# EAGLE design cytron-1 (EAGLE 9.6.2)
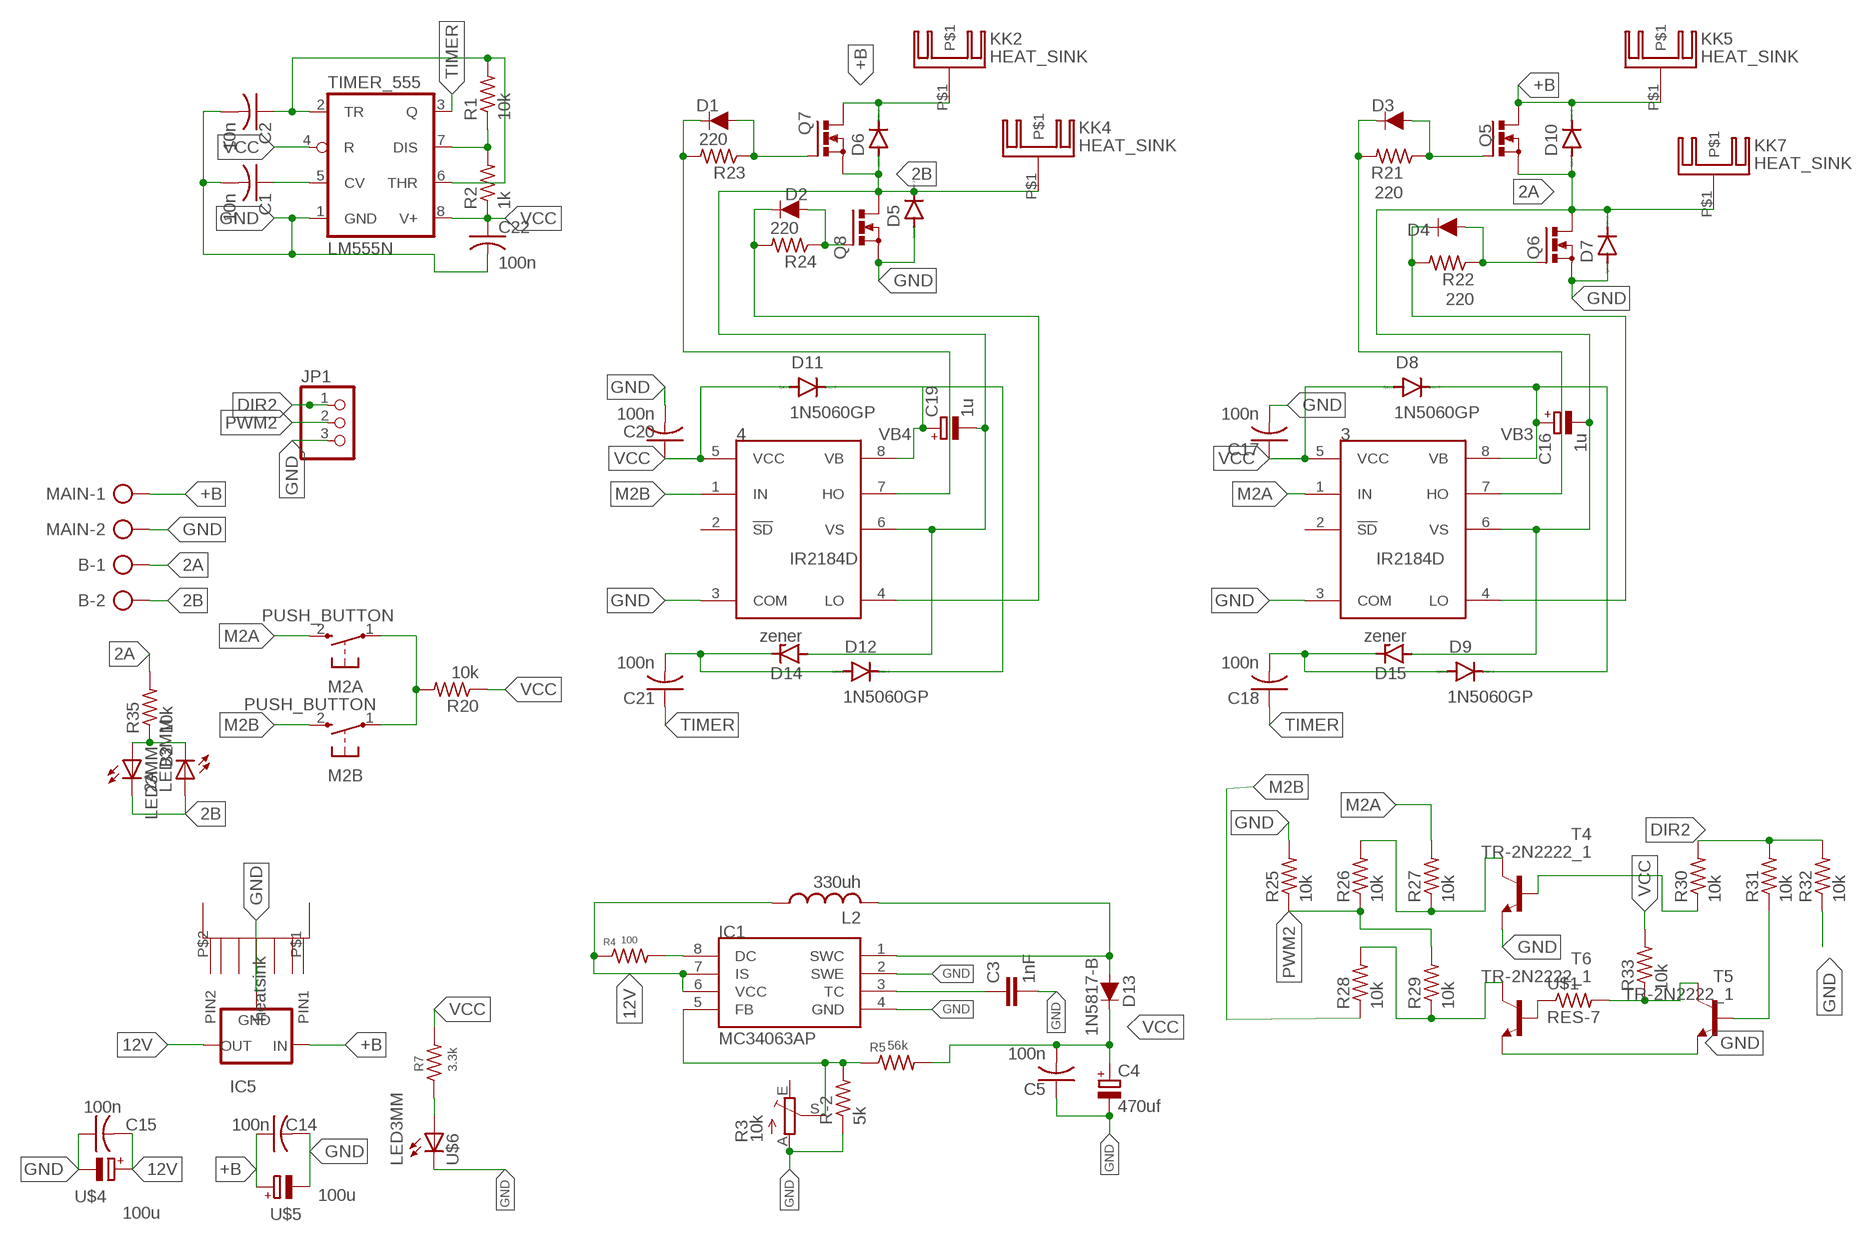
[diagram p0: schematic, sheet 1]

## Parts
2A  LED3MM  [LED3MM]
3  IR2184D  [DIL08]
4  IR2184D  [DIL08]
B  ROSTA.POWER  [W239-302]
B2  LED3MM  [LED3MM]
C1  10n  C-US025-025X050  [C025-025X050]
C2  10n  C-US025-025X050  [C025-025X050]
C3  1nF  CAPACITOR  [C025-025X050]
C4  470uf  CAP_POL  [E3,5-8]
C5  100n  C-US025-025X050  [C025-025X050]
C14  100n  C-US025-025X050  [C025-025X050]
C15  100n  C-US025-025X050  [C025-025X050]
C16  1u  CPOL-EUE5-5  [E5-5]
C17  100n  C-US025-025X050  [C025-025X050]
C18  100n  C-US025-025X050  [C025-025X050]
C19  1u  CPOL-EUE5-5  [E5-5]
C20  100n  C-US025-025X050  [C025-025X050]
C21  100n  C-US025-025X050  [C025-025X050]
C22  100n  C-US025-025X050  [C025-025X050]
D1  1A/50V/1.1V  DIODE(1A)-PTH  [DIODE-1N4001]
D2  1A/50V/1.1V  DIODE(1A)-PTH  [DIODE-1N4001]
D3  1A/50V/1.1V  DIODE(1A)-PTH  [DIODE-1N4001]
D4  1A/50V/1.1V  DIODE(1A)-PTH  [DIODE-1N4001]
D5  BY396  [DO201-15]
D6  BY396  [DO201-15]
D7  BY396  [DO201-15]
D8  1N5060GP  [DO15-12]
D9  1N5060GP  [DO15-12]
D10  BY396  [DO201-15]
D11  1N5060GP  [DO15-12]
D12  1N5060GP  [DO15-12]
D13  1N5817-B  DIODE(1A)-PTH  [DIODE-1N4001]
D14  zener  BZD23  [SOD81]
D15  zener  BZD23  [SOD81]
IC1  MC34063AP  [DIL08]
IC5  78XXS  [78XXS]
JP1  PINHD-3_DATA  [1X03_DATA]
KK2  HEAT_SINK  [SK95-2M3]
KK4  HEAT_SINK  [SK95-2M3]
KK5  HEAT_SINK  [SK95-2M3]
KK7  HEAT_SINK  [SK95-2M3]
L2  330uh  L-USWE-TPC  [POWER-CHOKE_WE-TPC]
M2A  PUSH_BUTTON  [B3F-10XX]
M2B  PUSH_BUTTON  [B3F-10XX]
MAIN  ROSTA.POWER  [W239-302]
Q5  MOSFET_NTO220BV  [TO220BV]
Q6  MOSFET_NTO220BV  [TO220BV]
Q7  MOSFET_NTO220BV  [TO220BV]
Q8  MOSFET_NTO220BV  [TO220BV]
R1  10k  R-US_0204/7  [0204/7]
R2  1k  R-US_0204/7  [0204/7]
R3  10k  TRIM_EU-CA6V  [CA6V]
R4  100  RES-7  [0204/7]
R5  56k  RES-7  [0204/7]
R7  3.3k  RES-7  [0204/7]
R20  10k  R-US_0204/7  [0204/7]
R21  220  R-US_0204/7  [0204/7]
R22  220  R-US_0204/7  [0204/7]
R23  220  R-US_0204/7  [0204/7]
R24  220  R-US_0204/7  [0204/7]
R25  10k  R-US_0204/7  [0204/7]
R26  10k  R-US_0204/7  [0204/7]
R27  10k  R-US_0204/7  [0204/7]
R28  10k  R-US_0204/7  [0204/7]
R29  10k  R-US_0204/7  [0204/7]
R30  10k  R-US_0204/7  [0204/7]
R31  10k  R-US_0204/7  [0204/7]
R32  10k  R-US_0204/7  [0204/7]
R33  10k  R-US_0204/7  [0204/7]
R35  10k  R-US_0204/7  [0204/7]
R-2  5k  RES-7  [0204/7]
T4  TR-2N2222_1  [TO92-EBC]
T5  TR-2N2222_1  [TO92-EBC]
T6  TR-2N2222_1  [TO92-EBC]
TIMER_555  LM555N  [DIL08]
U$1  RES-7  [0204/7]
U$3  HEAT-SINK  [HEAT_SINK]
U$4  100u  CAP_POL  [E3,5-8]
U$5  100u  CAP_POL  [E3,5-8]
U$6  LED3MM  [LED3MM]

## Nets
2A: 3.6(VS) B.1 C16.- D7.C D10.A D15.A KK7.P$1 Q5.S Q6.D R35.2
2B: 2A.K(C) 4.6(VS) B2.A B.2 C19.- D5.C D6.A D14.A KK4.P$1 Q7.S Q8.D
12V: C15.2 IC1.6(VCC) IC1.7(IS) IC5.OUT L2.1 R4.1 U$4.+
+B: C14.1 D6.C D10.C IC5.IN KK2.P$1 KK5.P$1 MAIN.1 Q5.D Q7.D U$5.+
DIR2: JP1.1 R30.2 R31.2 R32.2
GND: 3.3(COM) 4.3(COM) C1.2 C2.2 C3.2 C4.- C5.1 C14.2 C15.1 C17.2 C20.2 C22.2 D5.A D7.A IC1.2(SWE) IC1.4(GND) IC5.GND JP1.3 MAIN.2 Q6.S Q8.S R3.A R25.2 R32.1 R-2.1 T4.E T5.E T6.E TIMER_555.1(GND) U$4.- U$5.- U$6.K(C)
M2A: 3.1(IN) M2A.2(S) R27.2
M2B: 4.1(IN) M2B.2(S) R28.1
N$2: C1.1 TIMER_555.5(CV)
N$3: R1.1 R2.2 TIMER_555.7(DIS)
N$4: C2.1 R1.2 TIMER_555.2(TR) TIMER_555.6(THR)
N$5: D4.A Q6.G R22.1
N$6: 3.4(LO) D4.C R22.2
N$7: M2A.1(P) M2B.1(P) R20.2
N$8: T6.B U$1.1
N$9: C3.1 IC1.3(TC)
N$10: D13.A IC1.1(SWC) L2.2
N$11: 4.7(HO) D1.C R23.2
N$12: IC1.5(FB) R3.S R5.1 R-2.2
N$13: 4.4(LO) D2.C R24.2
N$15: IC1.8(DC) R4.2
N$16: R7.1 U$6.A
N$25: D3.A Q5.G R21.1
N$30: 3.7(HO) D3.C R21.2
N$31: C18.2 D9.A D15.C
N$32: D2.A Q8.G R24.1
N$33: D1.A Q7.G R23.1
N$36: C21.2 D12.A D14.C
N$37: R28.2 R29.1 T6.C
N$38: R26.2 R27.1 T4.C
N$39: R30.1 T4.B
N$40: R33.1 T5.C U$1.2
N$41: R31.1 T5.B
N$46: 2A.A B2.K(C) R35.1
PWM2: JP1.2 R25.1 R26.1 R29.2
TIMER: C18.1 C21.1 TIMER_555.3(Q)
VB3: 3.8(VB) C16.+ D8.C D9.C
VB4: 4.8(VB) C19.+ D11.C D12.C
VCC: 3.5(VCC) 4.5(VCC) C4.+ C5.2 C17.1 C20.1 C22.1 D8.A D11.A D13.C R2.1 R5.2 R7.2 R20.1 R33.2 TIMER_555.4(R) TIMER_555.8(V+)
Unconnected: 3.2(!SD) 4.2(!SD) R3.E U$3.P$1(PIN1) U$3.P$2(PIN2)

## Library data of the parts
2A B2 = MIA_LIBRARY-2-2-2:LED3MM
3 4 = MIA_LIBRARY-2-2-2:IR2184
B MAIN = MIA_LIBRARY-2-2-2:ROSTA.POWER: WAGO SCREW CLAMP; OC_FARNELL: unknown; OC_NEWARK: unknown
C1 C2 C5 C14 C15 C17 C18 C20-C22 = rcl8:C-US: CAPACITOR, American symbol; SPICEPREFIX: C
C3 = MIA_LIBRARY-2-2-2:CAPACITOR; SPICEPREFIX: C
C4 = MIA_LIBRARY-2-2-2:CAP_POL; SPICEPREFIX: C
C16 C19 = rcl8:CPOL-EU: POLARIZED CAPACITOR, European symbol; SPICEPREFIX: C
D1-D4 = MIA_LIBRARY-2-2-2:DIODE(1A): Diode These are standard reverse protection diodes and small signal diodes. SparkFun Products: SparkFun SparkPunk Sound Kit <https://www.sparkfun.com/products/11177> SparkFun ESP8266 Thing <https://www.sparkfun.com/products/13231>; PROD_ID: DIO-09176
D5-D7 D10 = diode:BY396: DIODE Si,100 V, 3 A
D8 D9 D11 D12 = diode:1N5060GP: DIODE controlled avalanche rectifier
D13 = MIA_LIBRARY-2-2-2:DIODE(1A): Diode These are standard reverse protection diodes and small signal diodes. SparkFun Products: SparkFun SparkPunk Sound Kit <https://www.sparkfun.com/products/11177> SparkFun ESP8266 Thing <https://www.sparkfun.com/products/13231>; PROD_ID: DIO-09176; SPICEPREFIX: D; VALUE: 1A/50V/1.1V
D14 D15 = diode:BZD23: Z DIODE
IC1 = MIA_LIBRARY-2-2-2:MC34063; SPICEPREFIX: X
IC5 = MIA_LIBRARY-2-2-2:78XXS: VOLTAGE REGULATOR
JP1 = MIA_LIBRARY-2-2-2:PINHD-3_DATA: PIN HEADER
KK2 KK4 KK5 KK7 = MIA_LIBRARY-2-2-2:HEAT_SINK: HEATSINK manufacturer Fischer/distributor Buerklin
L2 = rcl:L-US: INDUCTOR, American symbol; SPICEPREFIX: L
M2A M2B = MIA_LIBRARY-2-2-2:PUSH_BUTTON: OMRON SWITCH
Q5-Q8 = MIA_LIBRARY-2-2-2:MOSFET_N: Power MOSFET N-Channel
R1 R2 R20-R33 R35 = rcl8:R-US_: RESISTOR, American symbol; SPICEPREFIX: R
R3 = MIA_LIBRARY-2-2-2:TRIM_EU-: POTENTIOMETER; SPICEPREFIX: J
R4 R5 R7 = MIA_LIBRARY-2-2-2:RES-7; SPICEPREFIX: R
R-2 = MIA_LIBRARY-2-2-2:RES-7
T4-T6 = MIA_LIBRARY-2-2-2:TR-2N2222_1: NPN TRANSISTOR; SPICEPREFIX: J
TIMER_555 = linear:*555: TIMER
U$1 = MIA_LIBRARY-2-2-2:RES-7; SPICEPREFIX: B
U$3 = MIA_LIBRARY-2-2-2:HEAT-SINK
U$4 U$5 = MIA_LIBRARY-2-2-2:CAP_POL
U$6 = MIA_LIBRARY-2-2-2:LED3MM; SPICEPREFIX: B

## Board
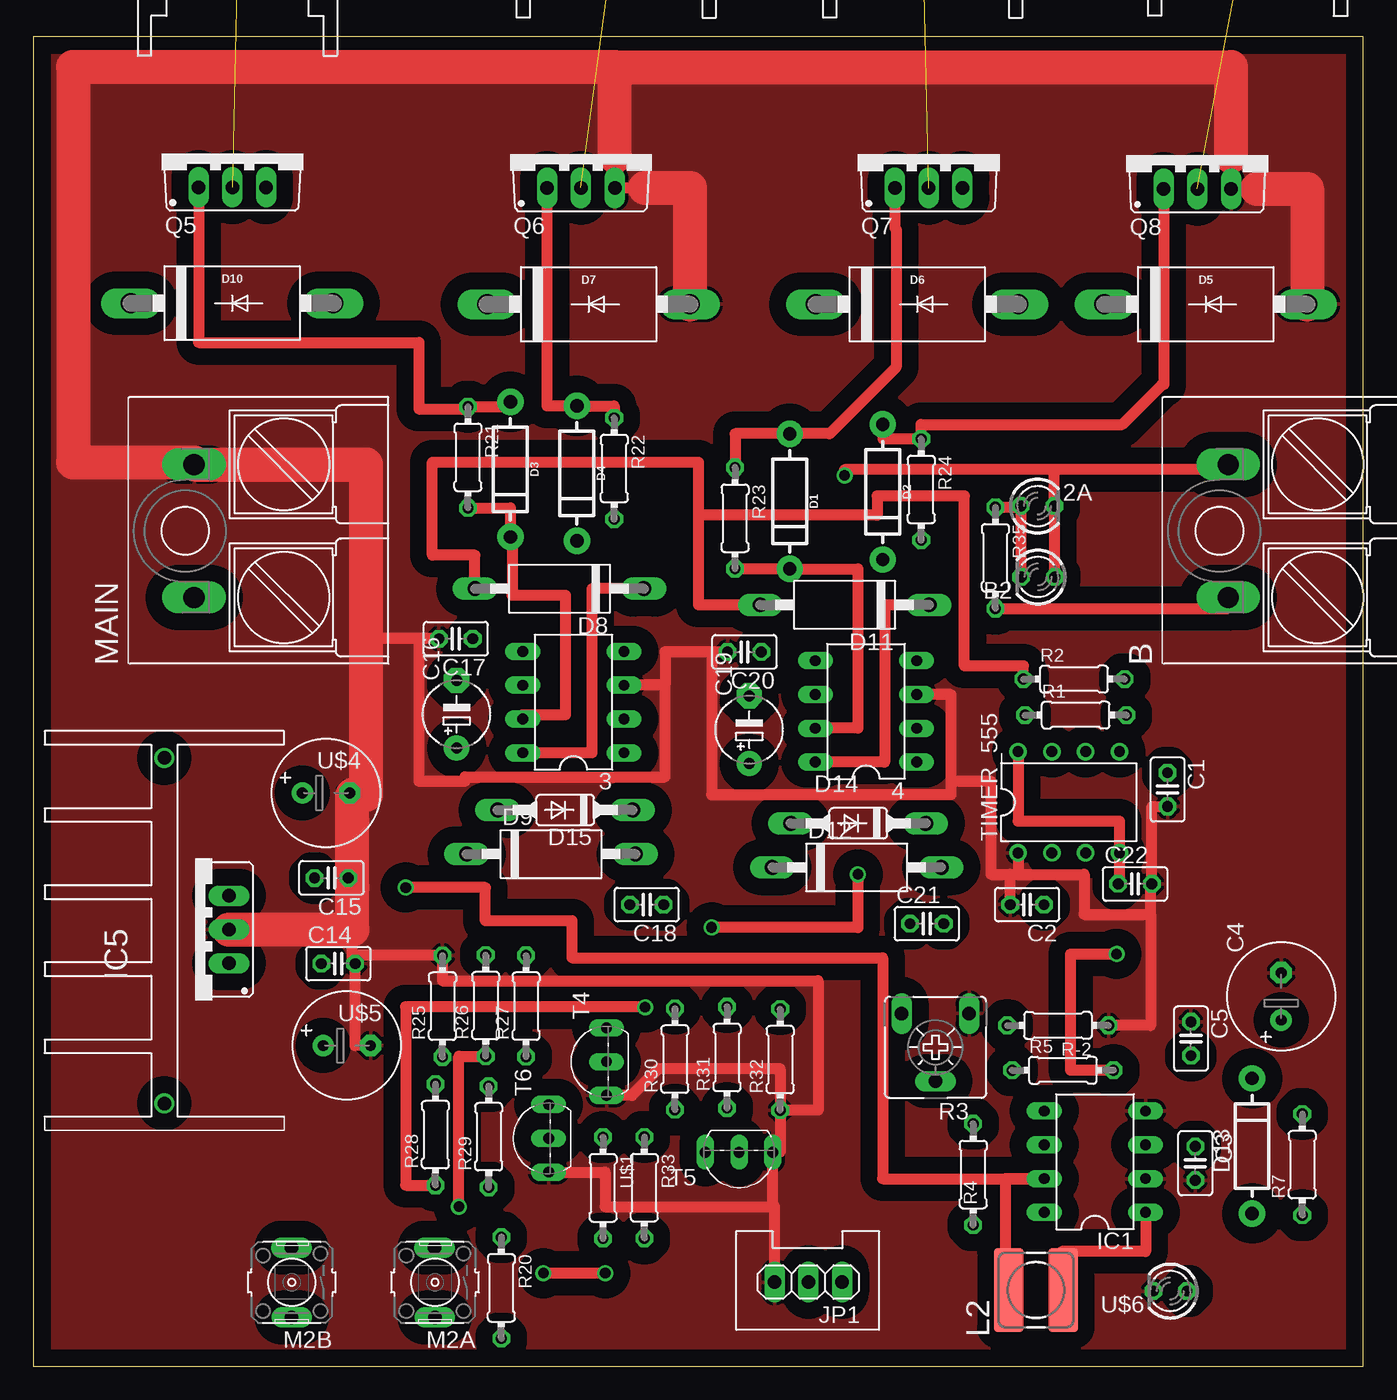
[diagram p1: board, top side]
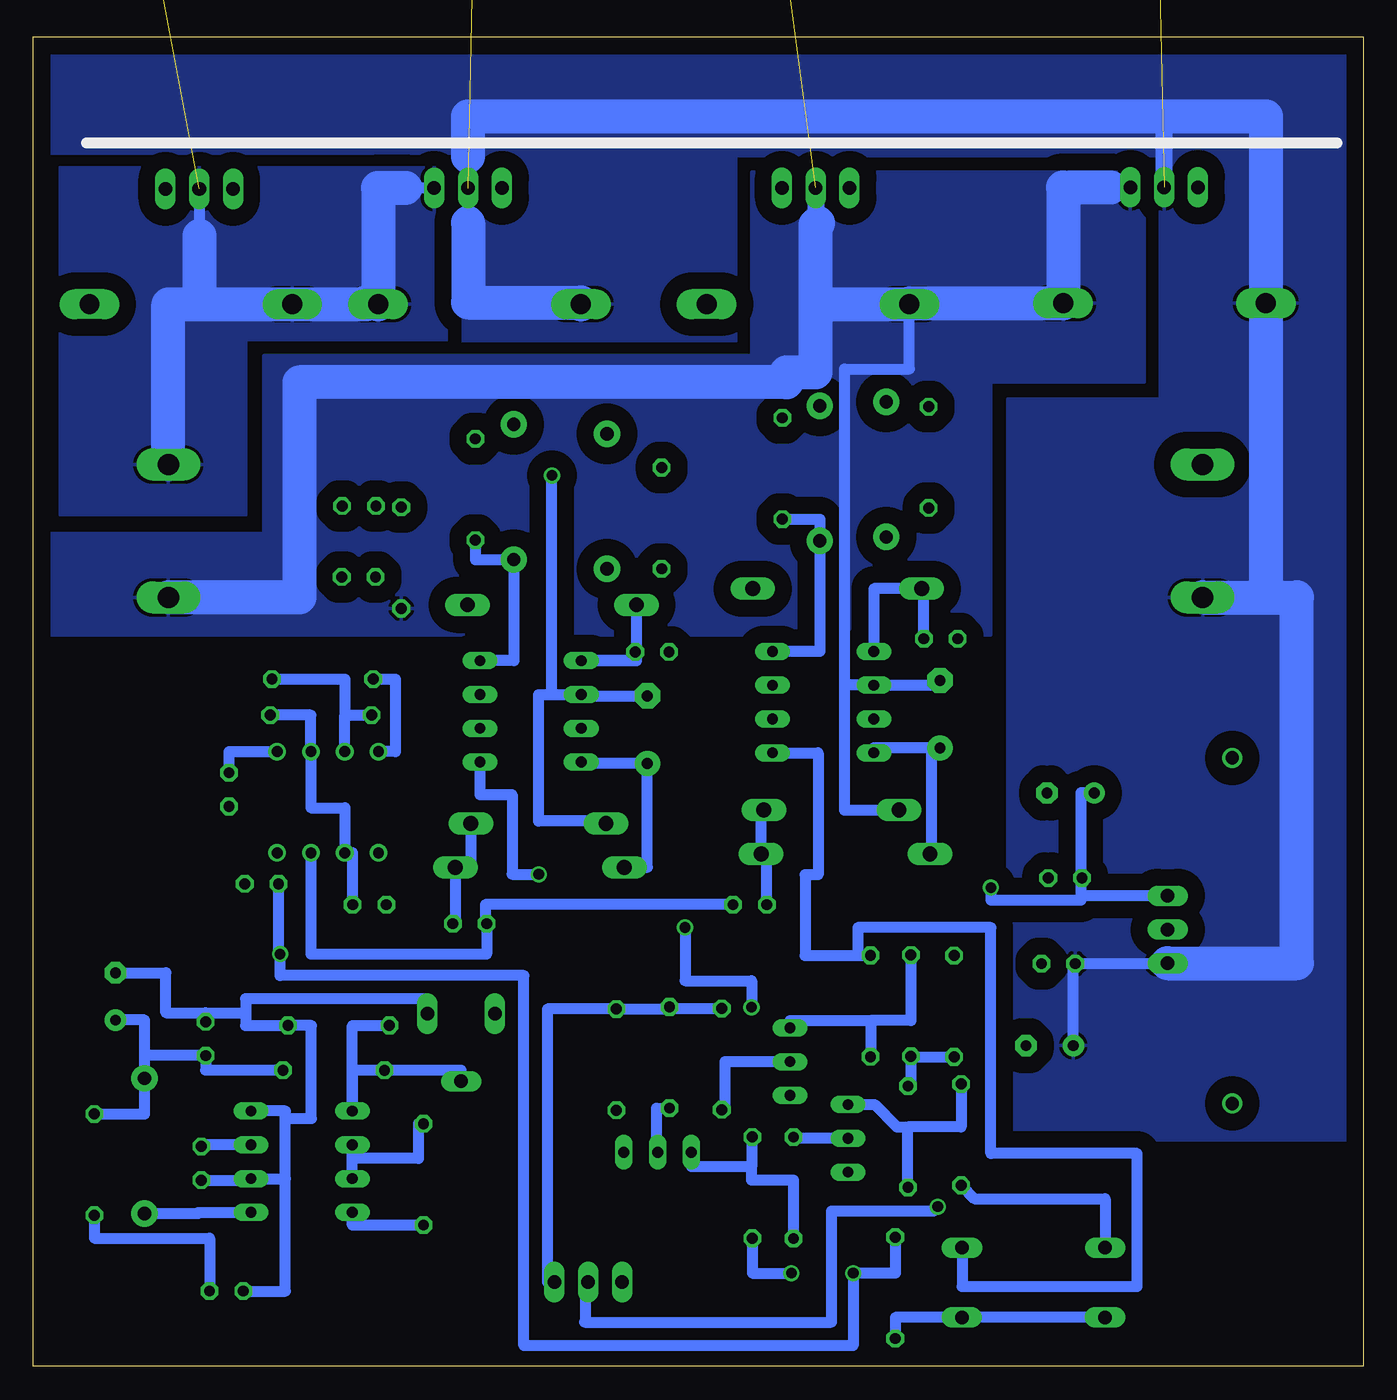
[diagram p2: board, bottom side, seen from below]

Size 100 x 100 mm. Coordinates in mm from the lower left corner, seen from the top.
Outline: 0,0 100,0 100,100 0,100 0,0
Copper layers (1*16): Top 0.035mm / dielectric 1.5mm / Bottom 0.035mm
Design rules "default *": minimum track width 6mil, minimum drill 0.35mm, track to track 0.8mm, track to pad 6mil, pad to pad 6mil, via to via 6mil, smd to smd 6mil, copper to edge 40mil, drill to drill 6mil, minimum pad ring 10mil, minimum via ring 8mil, stop-mask expansion 4mil, vias tented up to drill 0mil, thermal gap 10mil

### Footprints (pad centres in the part's own frame; a part is rotated, then mirrored left to right if it is on the bottom)
LED3MM = drill 0.813 octagon: A -1.27,0; K 1.27,0
DIL08 = drill 0.813 long: 1 -3.81,-3.81; 2 -1.27,-3.81; 3 1.27,-3.81; 4 3.81,-3.81; 5 3.81,3.81; 6 1.27,3.81; 7 -1.27,3.81; 8 -3.81,3.81
W239-302 = drill 1.6 long: 1 -5,5; 2 5,5
C025-025X050 = drill 0.813 octagon: 1 -1.27,0; 2 1.27,0
E3,5-8 = drill 0.813 pad 1.6: + -1.778,0 | drill 0.813 pad 1.6 octagon: - 1.778,0
E5-5 = drill 0.813 pad 1.905: + -2.54,0 | drill 0.813 pad 1.905 octagon: - 2.54,0
DIODE-1N4001 = drill 1 pad 1.981: A -5.08,0; C 5.08,0
DO201-15 = drill 1.499 long: A 7.62,0; C -7.62,0
DO15-12 = drill 1.118 long: A 6.35,0; C -6.35,0
SOD81 = drill 1.118 long: A 5.08,0; C -5.08,0
78XXS = drill 1.016 long: GND 0,-2.54; IN -2.54,-2.54; OUT 2.54,-2.54
1X03_DATA = drill 1.016 long: 1 -2.54,0; 2 0,0; 3 2.54,0
SK95-2M3 = drill 0.6 offset: P$1 0,2
POWER-CHOKE_WE-TPC = smd 6.3 x 2.2: 1 0,2.05; 2 0,-2.05
B3F-10XX = drill 1.016 long: 1 0.013,2.636; 2 0.029,-2.605
TO220BV = drill 1.016 long: D 0,-2.54; G -2.54,-2.54; S 2.54,-2.54
0204/7 = drill 0.813 octagon: 1 -3.81,0; 2 3.81,0
CA6V = drill 1.016 long: A -2.54,-2.54; E 2.54,-2.54; S 0,2.54
TO92-EBC = drill 0.813 long: B 0,-1.27; C 2.54,-1.27; E -2.54,-1.27
DIL08' = drill 0.813 pad 1.27: 1 -3.81,-3.81; 2 -1.27,-3.81; 3 1.27,-3.81; 4 3.81,-3.81; 5 3.81,3.81; 6 1.27,3.81; 7 -1.27,3.81; 8 -3.81,3.81
HEAT_SINK = drill 1: P$1 0,13; P$2 0,-13

### Placement (x,y rotation side)
2A  75.5,64.7 0 top
3  40.61,49.95 90 top
4  62.61,49.25 90 top
B  94.84,62.82 90 top
B2  75.54,59.36 180 top
C1  85.28,43.37 270 top
C2  74.72,34.72 180 top
C3  87.37,15.27 270 top
C4  93.82,27.82 90 top
C5  87.04,24.64 270 top
C14  22.93,30.28 0 top
C15  22.42,36.72 180 top
C16  31.83,49.04 90 top
C17  31.77,54.72 180 top
C18  46.12,34.72 180 top
C19  53.83,47.88 90 top
C20  53.47,53.72 180 top
C21  67.18,33.28 0 top
C22  82.83,36.28 0 top
D1  56.87,65.05 270 top
D2  63.87,65.75 270 top
D3  35.87,67.45 270 top
D4  40.87,67.15 270 top
D5  88.15,79.87 0 top
D6  66.45,79.87 0 top
D7  41.75,79.87 0 top
D8  39.56,58.48 180 top
D9  38.93,38.52 0 top
D10  14.95,79.95 0 top
D11  61,57.27 180 top
D12  61.91,37.52 0 top
D13  91.63,16.57 90 top
D14  62.02,40.83 180 top
D15  39.99,41.83 180 top
IC1  79.82,15.38 90 top
IC5  12.17,32.85 90 top
JP1  58.28,6.33 180 top
KK2  15.34,103.56 0 top  (outside the outline)
KK4  91.29,106.56 0 top  (outside the outline)
KK5  66.87,106.42 0 top  (outside the outline)
KK7  43.82,106.42 0 top  (outside the outline)
L2  75.39,5.74 90 top
M2A  30.2,6.31 180 top
M2B  19.44,6.31 180 top
MAIN  17.09,62.82 90 top
Q5  14.98,91.21 0 top
Q6  41.18,91.17 0 top
Q7  67.31,91.15 0 top
Q8  87.52,91.09 0 top
R1  78.37,48.98 0 top
R2  78.25,51.68 0 top
R3  67.83,23.98 180 top
R4  70.67,14.43 270 top
R5  77.41,22.27 0 top
R7  95.41,15.16 90 top
R20  35.19,5.9 270 top
R21  32.68,68.36 270 top
R22  43.68,67.52 270 top
R23  52.76,63.78 270 top
R24  66.76,65.94 270 top
R25  30.77,27.08 90 top
R26  34.02,27.12 90 top
R27  37.05,27.09 90 top
R28  30.24,17.42 90 top
R29  34.24,17.26 90 top
R30  48.24,23.1 90 top
R31  52.16,23.22 90 top
R32  56.16,23.06 90 top
R33  45.94,13.44 270 top
R35  72.33,60.8 270 top
R-2  77.04,25.64 180 top
T4  41.83,22.91 90 top
T5  53.06,14.83 180 top
T6  37.48,17.14 90 top
TIMER_555  LM555N  [DIL08']  77.85,42.42 0 top
U$1  42.84,13.42 270 top
U$3  9.86,32.76 180 top
U$4  22.01,43.12 0 top
U$5  23.58,24.12 0 top
U$6  85.48,5.66 180 top

### Tracks (layer width: path | path; a pad name or v marks a point on that pad's centre or on a via)
2A  (1 unrouted)
  Top 0.813: R35.2 89.84,56.99 B.1
  Bottom 0.813: C16.- 31.83,51.22 3.6 39,51.22 | D15.A 39,41.83 39,51.22 | 39,51.22 39,75 34.13,75 D7.C
  Bottom 1.27: 19,88.67 Q5.S | 22.57,88.67 22,88.67 | Q6.D 41.18,86.18 41,86
  Bottom 2.54: 41.18,79.87 D7.C 34.13,79.95 D10.A 22.57,88.67 | 41.18,79.87 41.18,74.75 43.38,74.75 43.38,74 80,74 80,57.82 B.1 | 41.18,79.87 41.18,85.82 41,86 | 22,88.67 19,88.67
  pour Bottom (isolate 1.27): 16.46,89.79 16.46,74 28,74 28,55 99,55 99,62.61 82.68,62.61 82.68,76 46,76 46,89.79
2B  (via drill 0.8)  (1 unrouted)
  Top 0.813: B.2 89.84,67.43 76.77,67.43 | 76.77,67.43 61,67.43 v61,67 | B2.A 76.77,59.36 2A.K 76.77,67.43
  Bottom 0.813: C19.- 58.8,50.42 4.6 61,50.52 | D14.A 56.94,41 62,41 62,50.52 61,50.52 | 61,50.52 v61,67 | Q7.S 72,88.61 | Q8.D 87.52,85
  Bottom 2.54: 87.52,85 87.52,79.87 | 87.52,79.87 D5.C 75,79.87 75,80 74.07,80 D6.A 74.07,88.61 72,88.61 | B.2 89.84,79.87 87.52,79.87
  pour Bottom (isolate 1.27): 68.91,90.17 68.91,77.18 84,77.18 84,64 98,64 98,90.17
12V  (via drill 0.8)
  Top 0.813: L2.1 73.09,5.74 73.09,14.12 IC1.7 63.87,14.12 63.87,30.72 40.5,30.72 40.5,33.5 34,33.5 34,36 v28,36
  Bottom 0.813: IC1.7 IC1.6 76.01,15.63 71.04,15.63 71.04,18.23 R4.1 | IC5.OUT 21.23,35.39 | U$4.+ 21.23,43.12 21.23,36.72 | C15.2 21.23,36.72 | 21.23,36.72 21.23,35.39 | 21.23,35.39 21.23,35.07 28,35.07 v28,36
+B  (2 unrouted)
  Bottom 0.813: U$5.+ 21.8,30.28 C14.1 14.71,30.28 IC5.IN | 67.31,86 Q7.D 67.31,91
  Bottom 1.27: Q5.D 14.98,94
  Bottom 2.54: MAIN.1 7.33,57.82 | 7.33,57.82 5,57.82 5,30.31 IC5.IN | 67.31,91 67.31,94 14.98,94 7.33,94 D10.C 7.33,57.82 | 67.31,86 67.31,80 58.83,80 D6.C
  pour Bottom (isolate 1.27): 99,99 99,91.19 67.76,91.19 67.76,77.09 47.12,77.09 47.12,90.99 15.36,91.01 15.36,72.77 26.8,72.77 26.8,17 1,17 1,99
DIR2
  Bottom 0.813: R30.2 52.16,26.91 R31.2 52.16,26.87 R32.2 61.34,26.87 61.34,6.33 JP1.1
GND
  Top 0.813: 69,44 69,43 51,43 51,53.72 C20.2 47.51,53.72 47.51,51.22 | 69,44 69,50.52 4.3 | C17.2 29,54.72 | 29,54.72 29,44 32.47,44 32.47,44.33 47.51,44.33 47.51,51.22 | 47.51,51.22 3.3 | 69,44 72,44 72,37 73.45,37 | C1.2 84.1,42.1 C22.2 84,36.28 84,34 | TIMER_555.1 74.04,37 | 74.04,37 79,37 79,34 84,34 | C2.2 73.45,37 | 73.45,37 74.04,37 | 84,34 84,25.64 R-2.1 | T6.E 43,14.6 43,12 55.6,12 | 55.6,12 T5.E 56.16,16.1 R32.1 | JP1.3 55.74,12 55.6,12 | T4.E 45,20.37 47,22.37 56.16,22.37 R32.1 | R32.1 59,19.25 59,29 30.77,29 R25.2 24.2,30.89 C14.2 | U$5.- 24.2,24.12 C14.2 | C15.1 24,36.72 24,36 | C14.2 24,30.28 24,32.85 | U$4.- 24,43.12 24,41 | 29,54.72 25,54.72 25,54 | 43.72,91 Q6.S 46,88.63 | 90.06,91 Q8.S 92,88.55
  Top 2.54: 90.06,91 90.06,97.71 43.72,97.71 | 43.72,97.71 3,97.71 3,68 12.09,68 MAIN.2 25,67.82 25,54 25,43 24,43 24,41 24,36 24,32.85 IC5.GND | 92,88.55 95.77,88.55 D5.A | 46,88.63 49.37,88.63 D7.A | 43.72,91 43.72,97.71
  Bottom 0.813: 81.04,14.12 IC1.2 83.63,13.99 C3.2 | IC1.4 81.04,19.2 81.04,18.64 | 81.04,14.12 81.04,18.64 | R3.A 70.37,27.64 84.04,27.64 84.04,26.59 | 84.04,26.59 84.04,25.64 R-2.1 79.09,25.64 79.09,18.64 81.04,18.64 | U$6.K 81.04,5.66 81.04,14.12 | C4.- 90.04,29.59 90.04,26.59 87.04,26.59 | 87.04,26.59 84.04,26.59 | C5.1 87.04,26.59
  pour Top (isolate 1.27): 1,1 99,1 99,2 99,99 80,99 1,99 1,84
M2A
  Bottom 0.813: M2A.2 30.17,6 17,6 17,16 28,16 28,33 38,33 38,30.9 R27.2 41.97,30.9 41.97,36.97 41,36.97 41,46.14 3.1
M2B  (via drill 0.8)
  Top 0.813: v62,37 62,33 v51,33 | v46,27 46.03,27.03 28,27.03 28,13.61 R28.1
  Bottom 0.813: R28.1 29.24,12.61 19.41,12.61 M2B.2 | 4.1 66.42,43 64,43 64,37 v62,37 | v51,33 51,29 46,29 v46,27
N$2
  Bottom 0.813: C1.1 85.28,46.23 TIMER_555.5
N$3
  Bottom 0.813: TIMER_555.7 76.58,48.98 | 76.58,48.98 R1.1 | R2.2 76.58,51.68 76.58,48.98
N$4
  Bottom 0.813: C2.1 75.99,38.61 TIMER_555.2 76.58,42 79.12,42 TIMER_555.6 79.12,48.98 R1.2
N$5
  Top 0.813: R22.1 43.68,72.23 D4.A 38.64,72.23 Q6.G
N$6
  Bottom 0.813: R22.2 40.87,63.71 D4.C 40.87,53.76 3.4
N$7
  Bottom 0.813: M2B.1 M2A.1 35.19,3.67 R20.2
N$8
  Bottom 0.813: T6.B 42.84,17.14 U$1.1
N$9
  Bottom 0.813: IC1.3 87.37,16.66 C3.1
N$10
  Top 0.813: IC1.1 83.63,8.63 77.34,8.63 77.44,8.54 L2.2
  Bottom 0.813: IC1.1 87.63,11.57 87.63,11.49 D13.A
N$11
  Top 0.813: 4.7 58.8,48 62,48 62,59.97 D1.C R23.2
N$12
  Bottom 0.813: R-2.2 76.01,25.64 IC1.5 76.01,22.27 R5.1 67.83,22.27 R3.S
N$13
  Bottom 0.813: R24.2 66.76,60.67 D2.C 63.87,53.06 4.4
N$15
  Bottom 0.813: R4.2 76.01,10.62 IC1.8
N$16
  Bottom 0.813: R7.1 95.41,9.63 86.75,9.63 U$6.A
N$25
  Top 0.813: Q5.G 12.44,77 29,77 29,72 32.68,72 R21.1 35.87,72.17 D3.A
N$30
  Top 0.813: 3.7 36.8,49 40,49 40,58 36,58 36,62.37 D3.C 35.87,64.55 R21.2
N$31
  Bottom 0.813: D15.C 45.28,41.83 D9.A 44.85,38.52 C18.2
N$32
  Top 0.813: D2.A 63.87,69.75 R24.1 66.76,70.83 81.87,70.83 84.87,73.83 85,73.83 85,88.53 Q8.G
N$33
  Top 0.813: Q7.G 64.78,85.61 64.87,85.52 64.87,75.13 59.87,70.13 D1.A 52.76,70.13 R23.1
N$36
  Bottom 0.813: D14.C 67.1,37.52 D12.A 68.26,33.28 C21.2
N$37
  Bottom 0.813: R28.2 30.24,18 34.24,18 | R29.1 34.24,18 | T6.C 36.75,19.68 35.07,18 34.24,18
N$38
  Bottom 0.813: R26.2 34.02,26 37.05,26 | 37.05,26 R27.1 | T4.C 43.1,26 37.05,26
N$39
  Bottom 0.813: T4.B 48,22.91 48,19.29 R30.1
N$40
  Bottom 0.813: R33.1 46,17.25 46,15 | 46,15 50.52,15 T5.C | U$1.2 42.84,14 46,14 46,15
N$41
  Bottom 0.813: T5.B 53.06,17.1 53.16,17.2 53.16,19.41 R31.1
N$46
  Top 0.813: R35.1 74.23,64.61 | 74.23,64.61 2A.A | B2.K 74.27,64.61 74.23,64.61
PWM2  (via drill 0.8)
  Top 0.813: v32,12 32,23.31 R26.1
  Bottom 0.813: R25.1 33.98,23.27 R26.1 34.02,21.07 R29.2 | v32,12 32.32,11.68 40,11.68 40,3.32 58.55,3.32 58.51,3.37 58.51,6.1 JP1.2
TIMER
  Bottom 0.813: C18.1 66,34.72 66,33.28 C21.1 65.91,31 79.12,31 TIMER_555.3
VB3
  Top 0.813: D8.C 42,58.48 42,46.14 3.8
  Bottom 0.813: 3.8 36.8,46.5 C16.+ 32.47,46.5 32.47,38.63 D9.C
VB4
  Top 0.813: D11.C 64,57.27 64,45.44 4.8
  Bottom 0.813: 4.8 58.8,45.34 C19.+ 53.83,37.52 D12.C
VCC  (via drill 0.8)
  Top 0.813: TIMER_555.8 74.04,41 81.66,41 TIMER_555.4 81.66,36.28 C22.1 | R5.2 78,22.27 78,31 v81.44,31 | D8.A 33.21,61 30,61 30,68 50,68 50,64 | D11.A 50,57.27 50,64 | v43,7 v38.35,7 | R2.1 74.44,52.68 70,52.68 70,65.45 63.44,65.45 63.44,64 50,64
  Bottom 0.813: R5.2 87.04,22.27 C5.2 91.63,23.36 | R2.1 72.77,51.68 72.77,46.23 TIMER_555.8 | D11.A 54.65,53.06 4.5 54.74,53.06 C20.1 | 3.5 36.8,58.48 D8.A 33.04,58.48 C17.1 | C22.1 81.56,31 v81.44,31 81.44,29.38 63.12,29.38 63.12,1.56 38.35,1.56 v38.35,7 35.19,7 R20.1 | R33.2 45.94,7 v43,7 | R7.2 91.63,18.98 D13.C 91.63,23.36 | 91.63,23.36 91.63,26.04 C4.+